# EAGLE design USB-to-ESP-UART_v4.1 (EAGLE 9.6.2)
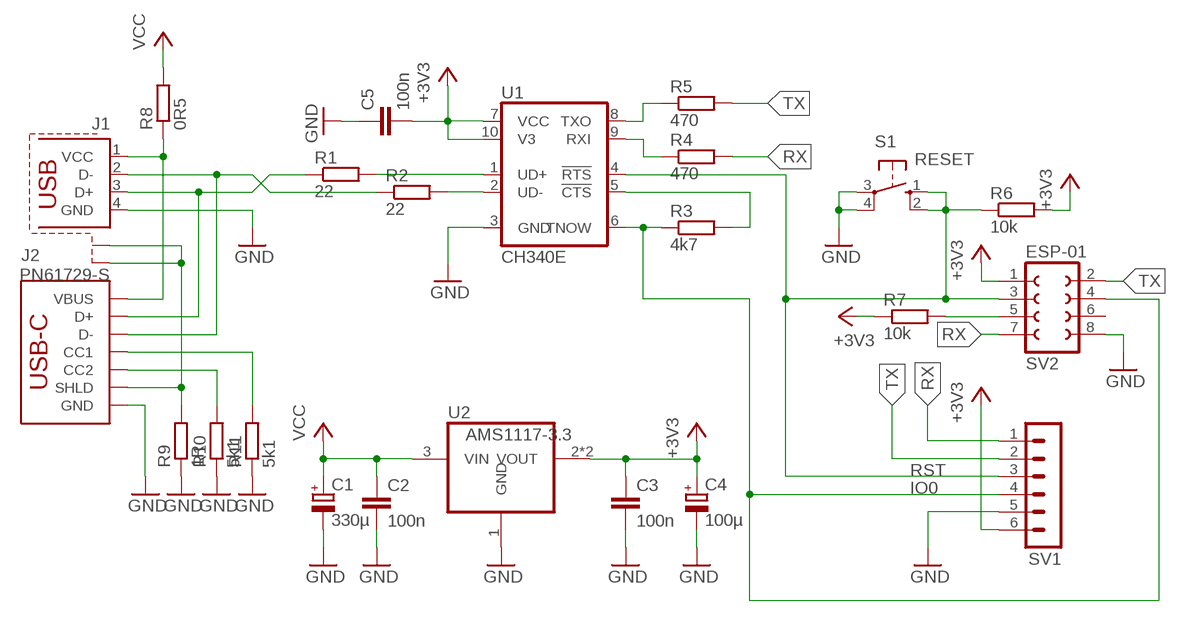
[diagram p0: schematic, sheet 1]

## Parts
C1  330µ  CPOL-EUE2.5-7  [E2,5-7]
C2  100n  C-EUC1206  [C1206]
C3  100n  C-EUC1206  [C1206]
C4  100µ  CPOL-EUE2.5-5  [E2,5-5]
C5  100n  C-EUC1206  [C1206]
J1  PN61729-S  [PN61729-S]
J2  USB_C_2-LAYER_PADS  [USB-C-16P-2LAYER-PADS]
R1  22  R-EU_R1206  [R1206]
R2  22  R-EU_R1206  [R1206]
R3  4k7  R-EU_R1206  [R1206]
R4  470  R-EU_R1206  [R1206]
R5  470  R-EU_R1206  [R1206]
R6  10k  R-EU_R1206  [R1206]
R7  10k  R-EU_R1206  [R1206]
R8  0R5  R-EU_R1206  [R1206]
R9  1R  R-EU_R1206  [R1206]
R10  5k1  R-EU_R1206  [R1206]
R11  5k1  R-EU_R1206  [R1206]
S1  RESET  10-XX  [B3F-10XX]
SV1  MA06-1  [MA06-1]
SV2  ESP-01  FE04-2CLEAN  [FE04-2-CL]
U1  CH340E  CH340E_MSOP10  [MSOP10]
U2  AMS1117-3.3  REG1117  [SOT223]

## Nets
+3V3: C3.1 C4.+ C5.2 R6.2 R7.1 SV1.6 SV2.1 U1.7(VCC) U1.10(V3) U2.2(VOUT) U2.4(VOUT)
GND: C1.- C2.2 C3.2 C4.- C5.1 J1.4(GND) J2.GND J2.GND2(GND) R9.1 R10.1 R11.1 S1.3(P) S1.4(P1) SV1.5 SV2.8 U1.3(GND) U2.1(GND)
IO0: R3.1 SV1.4 SV2.4 U1.6(TNOW)
N$2: R3.2 U1.5(!CTS)
N$5: R4.1 U1.9(RXI)
N$6: R5.1 U1.8(TXO)
N$7: R1.2 U1.1(UD+)
N$8: R2.2 U1.2(UD-)
N$10: J2.B5(CC2) R10.2
N$12: J1.S1 J1.S2 J2.SHLD1(SHLD) J2.SHLD2(SHLD) J2.SHLD3(SHLD) J2.SHLD4(SHLD) R9.2
N$13: J2.A5(CC1) R11.2
N$14: J1.2(D-) J2.A7(D-) J2.B7(D-) R2.1
N$15: J1.3(D+) J2.A6(D+) J2.B6(D+) R1.1
N$16: J1.1(VCC) J2.VBUS1(VBUS) J2.VBUS2(VBUS) R8.1
N$19: R7.2 SV2.5
RST: R6.1 S1.1(S) S1.2(S1) SV1.3 SV2.3 U1.4(!RTS)
RX: R4.2 SV1.1 SV2.7
TX: R5.2 SV1.2 SV2.2
VCC: C1.+ C2.1 R8.2 U2.3(VIN)
Unconnected: SV2.6

## Library data of the parts
C1 C4 = rcl-custom:CPOL-EU: POLARIZED CAPACITOR, European symbol; SPICEPREFIX: C
C2 C3 C5 = rcl-custom:C-EU: CAPACITOR, European symbol; SPICEPREFIX: C
J1 = con-berg-custom:PN61729-S: BERG USB connector; OC_FARNELL: unknown; OC_NEWARK: unknown
J2 = SparkFun-Connectors-custom:USB_C: USB Type C 16Pin Connector Super Speed pins not available on the 16-pin purely SMD connector so this part is best for USB 2.0 implementations. D1 and D2 are tied together enabling D+/- no matter which way the cable is plugged into the connector. The two channel configuration pins (CC1/2) are exposed. These are normally connected to ground via 5.1k resistors but can be reconfigured for high current/high power applications. **4-LAYER BOARD WARNING!!** If designing 4-layer board, make sure to select the variant _4-LAYER-ISOLATED. The linked footprint (USB-C-16-4LAYER-ISOLATED) includes some very necessary cutout polygons in the inner layers (2 and 15). This prevents the PTH mounting shield legs on the USB connector from electrically connecting any other polygons on the inner layers (usually VCC and GND).; PROD_ID: CONN-14122
R1-R11 = rcl-custom:R-EU_: RESISTOR, European symbol; SPICEPREFIX: R
S1 = switch-omron:10-XX: OMRON SWITCH; MPN: B3F-1000; OC_FARNELL: 176432; OC_NEWARK: 36M3542
SV1 = con-lstb-custom:MA06-1: PIN HEADER; OC_FARNELL: unknown; OC_NEWARK: unknown
SV2 = con-lsta-custom:FE04-2: FEMALE HEADER
U1 = CH340E:CH340E: Check availability <https://pricing.snapeda.com/parts/CH340E/WCH/view-part?ref=eda>; AVAILABILITY: Not in stock; DESCRIPTION: USB to serial chip CH340; MF: WCH; MP: CH340E; PACKAGE: Package; PRICE: None
U2 = burr-brown-custom:REG1117: 800mA and 1A Low Dropout (LDO) Positive Regulator 1.8V, 2.5V, 2.85V, 3.3V, 5V, and Adj; MPN: REG1117; OC_FARNELL: 1097566; OC_NEWARK: 14P6981

## Board
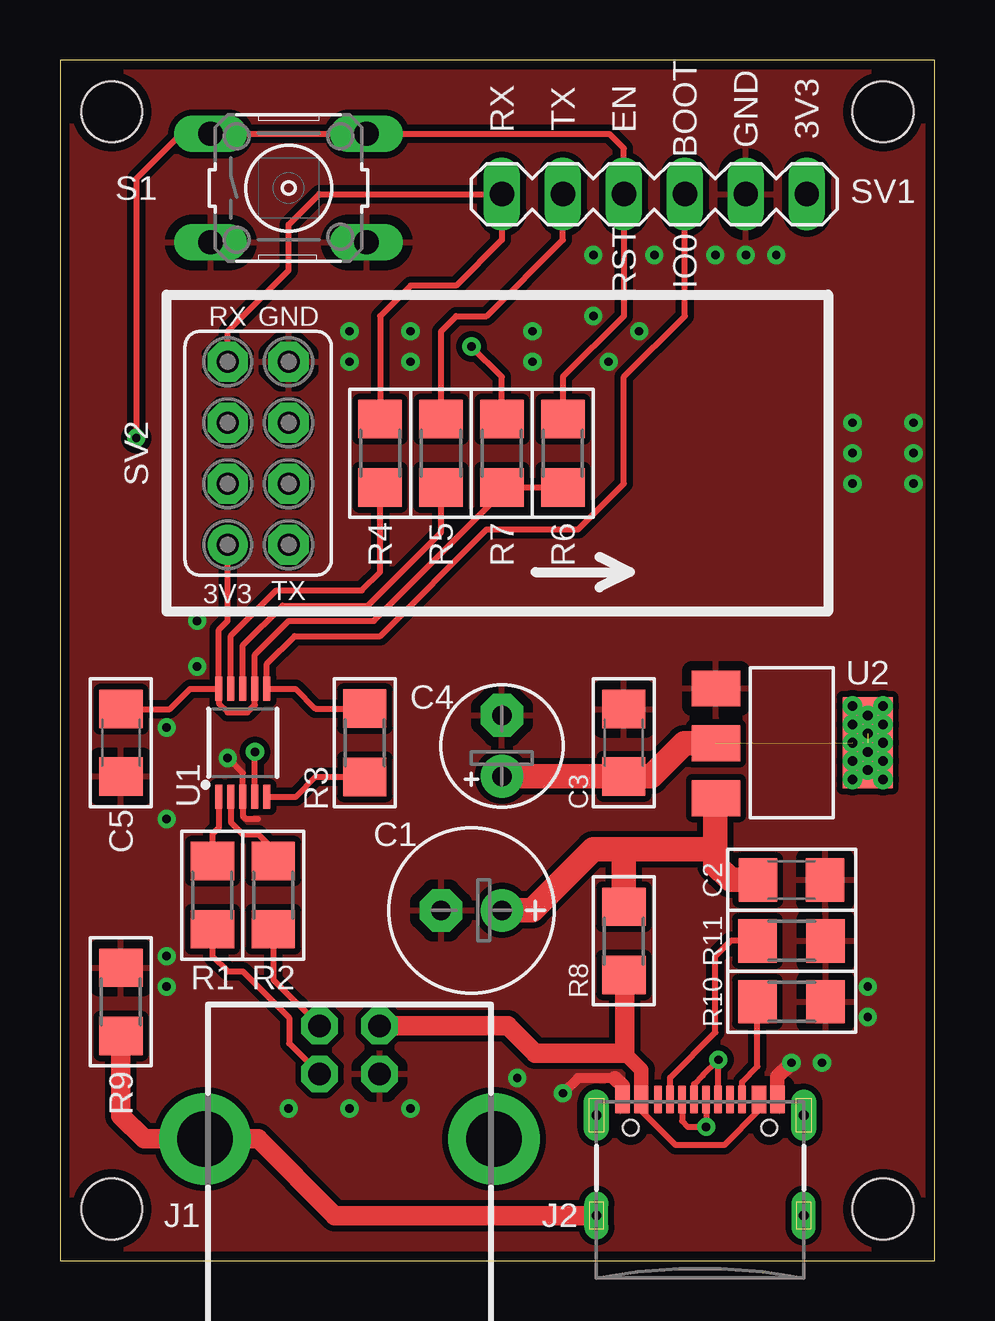
[diagram p1: board, top side]
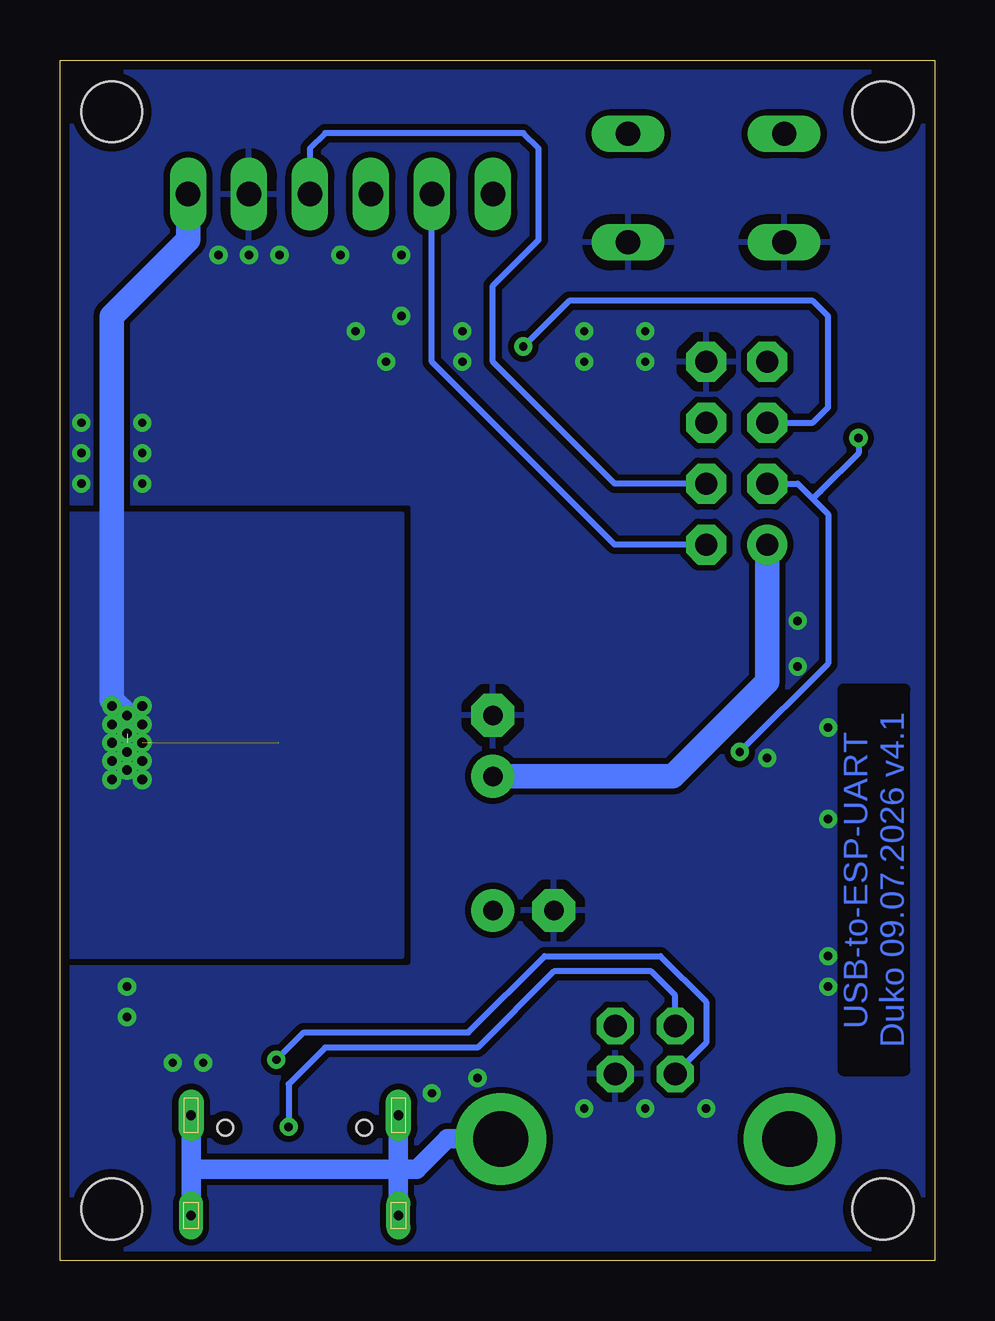
[diagram p2: board, bottom side, seen from below]

Size 36.45 x 50.04 mm. Coordinates in mm from the lower left corner, seen from the top.
Outline: 0,0 36.45,0 36.45,50.04 0,50.04 0,0
Copper layers (1*16): Top 0.035mm / dielectric 1.5mm / Bottom 0.035mm
Design rules "default *": minimum track width 6mil, minimum drill 0.35mm, track to track 6mil, track to pad 6mil, pad to pad 6mil, via to via 6mil, smd to smd 6mil, copper to edge 15mil, drill to drill 6mil, minimum pad ring 10mil, minimum via ring 8mil, stop-mask expansion 4mil, vias tented up to drill 14mil, thermal gap 16mil
Holes 2.54 mm at 2.16,2.16 34.29,2.16 2.16,47.88 34.29,47.88

### Footprints (pad centres in the part's own frame; a part is rotated, then mirrored left to right if it is on the bottom)
E2,5-7 = drill 0.813 pad 1.778: + -1.27,0 | drill 0.813 pad 1.778 octagon: - 1.27,0
C1206 = smd 1.6 x 1.8: 1 -1.4,0; 2 1.4,0
E2,5-5 = drill 0.813 pad 1.778: + -1.27,0 | drill 0.813 pad 1.778 octagon: - 1.27,0
PN61729-S = drill 0.95 pad 1.524 octagon: 1 1.25,4.71; 2 -1.25,4.71; 3 -1.25,2.71; 4 1.25,2.71 | drill 2.3 pad 3.81: S1 -6.02,0; S2 6.02,0
USB-C-16P-2LAYER-PADS = smd 0.3 x 1.152: A5 -1.25,-0.264; A6 -0.25,-0.264; A7 0.25,-0.264; A8 1.25,-0.264; B5 1.75,-0.264; B6 0.75,-0.264; B7 -0.75,-0.264; B8 -1.75,-0.264 | smd 0.6 x 1.152: GND -3.225,-0.264; GND2 3.225,-0.264; VBUS1 -2.45,-0.264; VBUS2 2.45,-0.264 | drill 0.4 pad 1.067 long: SHLD1 -4.318,-0.915; SHLD2 4.318,-0.915 | drill 0.4 pad 0.991 long: SHLD3 -4.318,-5.095; SHLD4 4.318,-5.095 | hole 0.65: -2.89,-1.445; 2.89,-1.445
R1206 = smd 1.6 x 1.803: 1 -1.422,0; 2 1.422,0
B3F-10XX = drill 1.016 long: 1 -3.251,2.261; 2 3.251,2.261; 3 -3.251,-2.261; 4 3.251,-2.261
MA06-1 = drill 1.016 long: 1 -6.35,0; 2 -3.81,0; 3 -1.27,0; 4 1.27,0; 5 3.81,0; 6 6.35,0
FE04-2-CL = drill 0.914 pad 1.676: 1 -5.08,1.27 | drill 0.914 pad 1.676 octagon: 2 -5.08,-1.27; 3 -2.54,1.27; 4 -2.54,-1.27; 5 0,1.27; 6 0,-1.27; 7 2.54,1.27; 8 2.54,-1.27
MSOP10 = smd 1 x 0.3: 1 -2.25,1; 2 -2.25,0.5; 3 -2.25,0; 4 -2.25,-0.5; 5 -2.25,-1; 6 2.25,-1; 7 2.25,-0.5; 8 2.25,0; 9 2.25,0.5; 10 2.25,1
SOT223 = smd 1.499 x 2.007: 1 -2.261,-3.15; 2 0.025,-3.15; 3 2.311,-3.15 | smd 3.81 x 2.083: 4 0,3.175

### Placement (x,y rotation side)
C1  17.14,14.61 180 top
C2  30.48,15.88 0 top
C3  23.5,21.59 90 top
C4  18.41,21.46 90 top
C5  2.54,21.59 90 top
J1  12.06,5.08 0 top
J2  26.67,6.99 0 top
R1  6.35,15.24 90 top
R2  8.89,15.24 90 top
R3  12.7,21.59 270 top
R4  13.34,33.66 90 top
R5  15.88,33.66 90 top
R6  20.95,33.66 270 top
R7  18.41,33.66 90 top
R8  23.5,13.34 90 top
R9  2.54,10.79 270 top
R10  30.48,10.79 180 top
R11  30.48,13.34 180 top
S1  9.53,44.7 0 top
SV1  24.77,44.45 0 top
SV2  8.26,34.92 90 top
U1  7.62,21.59 90 top
U2  30.48,21.59 270 top

### Tracks (layer width: path | path; a pad name or v marks a point on that pad's centre or on a via)
+3V3  (via drill 0.4)  (2 unrouted)
  Top 0.254: R6.2 R7.1 18.41,32 13.08,26.67 9.53,26.67 8.12,25.27 U1.7 8.12,23.17 7.81,22.86 6.99,22.86 6.62,23.23 U1.10 | U1.10 6.62,26.3 6.99,26.67 SV2.1 | C5.2 4.58,22.99 5.42,23.84 U1.10
  Top 0.813: C3.1
  Top 1.016: C4.+ C3.1 | C3.1 24.64,20.19 26.01,21.57 U2.2
  Bottom 1.016: C4.+ 10.92,20.19 6.99,24.13 SV2.1 | SV1.6 31.11,42.55 34.29,39.37 34.29,23.37 v33.66,22.73
  other vias: 33.66,21.21 34.29,21.59 33.02,21.59 33.02,22.35 33.66,21.97 34.29,22.35 34.29,23.11 33.02,23.11 33.02,20.83 33.66,20.45 34.29,20.83 34.29,20.07 33.02,20.07
  pour Bottom (isolate 0.254): 22.23,31.11 22.23,12.7 36.2,12.7 36.2,31.11
GND  (via drill 0.35)
  Top 0.254: 8.26,18.41 7.75,18.41 7.62,18.54 U1.3 7.62,20.32 v6.99,20.95
  Top 0.406: J2.GND 23.45,7.29 | 23.11,7.62 21.59,7.62 v20.95,6.99
  Top 0.61: 23.45,7.29 23.11,7.62 | J2.GND2 29.89,7.67 v30.48,8.26
  other vias: 29.84,41.91 28.57,41.91 27.3,41.91 12.06,38.73 12.06,37.47 14.61,38.73 14.61,37.47 5.71,26.67 5.71,24.77 4.45,11.43 4.45,12.7 33.66,11.43 33.66,10.16 35.56,32.38 35.56,33.66 35.56,34.92 33.02,32.38 33.02,33.66 33.02,34.92 9.53,6.35 14.61,6.35 12.06,6.35 24.13,38.73 22.86,37.47 4.45,18.41 4.45,22.23 19.68,37.47 19.68,38.73 22.23,39.37 22.23,41.91 24.77,41.91 31.75,8.26 19.05,7.62
  pour Bottom (isolate 0.254, rank 2): -1.91,51.94 -1.91,-1.91 38.1,-1.91 38.1,51.94
  pour Top (isolate 0.254): -3.81,53.85 -3.81,-3.81 40.01,-3.81 40.01,53.85
IO0
  Top 0.254: SV1.4 26.04,39.37 23.5,36.83 23.5,32.38 21.59,30.48 17.78,30.48 13.34,26.04 9.78,26.04 8.62,24.88 U1.6 9.81,23.84 10.64,23.01 R3.1
  Bottom 0.254: SV2.4 13.34,32.38 18.41,37.47 18.41,40.64 16.51,42.55 16.51,46.35 17.14,46.99 25.4,46.99 26.04,46.35 SV1.4
N$2
  Top 0.254: U1.5 9.81,19.34 10.64,20.17 R3.2
N$5
  Top 0.254: U1.9 7.12,26.04 9.02,27.94 12.57,27.94 13.34,28.7 R4.1
N$6
  Top 0.254: U1.8 7.62,25.65 9.27,27.3 12.83,27.3 14.1,28.57 15.88,30.35 R5.1
N$7
  Top 0.254: U1.1 6.62,18.05 6.35,17.78 R1.2
N$8
  Top 0.254: U1.2 7.12,18.28 7.62,17.78 8.26,17.78 8.89,17.14 R2.2
N$10
  Top 0.254: J2.B5 28.42,7.46 29.06,8.1 R10.2
N$12
  Top 0.813: R9.2 2.54,6.04 3.5,5.08 J1.S1 8.26,5.08 11.45,1.89 J2.SHLD3
  Bottom 0.813: J2.SHLD1 22.35,3.81 | J2.SHLD3 22.35,3.81 | J2.SHLD2 30.99,3.81 | 30.99,3.81 J2.SHLD4 | J1.S2 20.32,5.08 21.59,3.81 22.35,3.81 | 22.35,3.81 30.99,3.81
N$13
  Top 0.254: R11.2 27.94,13.34 27.3,12.7 27.3,9.53 25.42,7.64 J2.A5
N$14  (via drill 0.35)
  Top 0.254: J2.A7 v26.92,5.59 26.16,5.59 25.92,5.83 J2.B7 | J1.2 8.89,11.71 R2.1
  Bottom 0.254: J1.2 10.81,11.07 11.81,12.06 15.88,12.06 19.05,8.89 25.4,8.89 26.92,7.37 v26.92,5.59
N$15  (via drill 0.35)
  Top 0.254: J1.3 9.54,9.06 9.54,10.14 7.62,12.06 6.99,12.06 6.35,12.7 R1.1 | J2.B6 v27.42,8.37 | v27.42,8.37 26.79,7.74 26.42,7.37 J2.A6 | v27.42,8.37 v27.43,8.38
  Bottom 0.254: v27.43,8.38 26.29,9.53 19.43,9.53 16.26,12.7 11.43,12.7 9.53,10.79 9.53,9.08 J1.3
N$16
  Top 0.254: J2.VBUS2 29.12,6.28 27.67,4.83 25.65,4.83 24.22,6.26 J2.VBUS1
  Top 0.61: J2.VBUS1 24.22,6.66 24.22,7.97 23.53,8.65
  Top 0.813: J1.1 18.65,9.79 19.79,8.65 21.59,8.65 22.48,8.65 23.53,8.65 23.53,11.88 R8.1
N$19  (via drill 0.35)
  Top 0.254: R7.2 18.41,36.83 v17.14,38.1
  Bottom 0.254: SV2.5 5.08,34.92 4.45,35.56 4.45,39.37 5.08,40.01 15.24,40.01 v17.14,38.1
RST  (via drill 0.35)
  Top 0.254: R6.1 20.95,36.83 23.5,39.37 SV1.3 23.5,46.35 22.89,46.97 S1.2 S1.1 5.05,46.97 3.17,45.09 v3.17,34.29 | U1.4 v8.12,21.2 v8.13,21.21
  Bottom 0.254: v3.17,34.29 3.17,33.66 4.76,32.07 5.08,31.75 | v8.13,21.21 4.45,24.89 4.45,31.11 5.08,31.75 | 5.08,31.75 5.71,32.38 SV2.3
RX
  Top 0.254: SV2.7 6.99,38.73 9.53,41.27 9.53,43.18 10.79,44.45 SV1.1 18.41,42.55 16.51,40.64 14.61,40.64 13.34,39.37 R4.2
TX
  Top 0.254: R5.2 15.88,38.73 16.51,39.37 17.78,39.37 20.95,42.55 SV1.2
  Bottom 0.254: SV2.2 13.34,29.84 20.95,37.47 SV1.2
VCC
  Top 0.813: 27.3,19.25 U2.3
  Top 1.016: 27.3,17.14 27.3,16.51 27.94,15.88 C2.1 | 23.5,17.14 22.23,17.14 19.68,14.61 C1.+ | 23.5,17.14 27.3,17.14 | 27.3,17.14 27.3,19.25 | R8.2 23.5,17.14

### Text on the board
Bottom: USB-to-ESP-UART / Duko 09.07.2026 v4.1
tNames: RX | TX | EN | BOOT | GND | 3V3 | RST | IO0 | RX | GND | 3V3 | TX
tDocu: JLCJLCJLCJLC